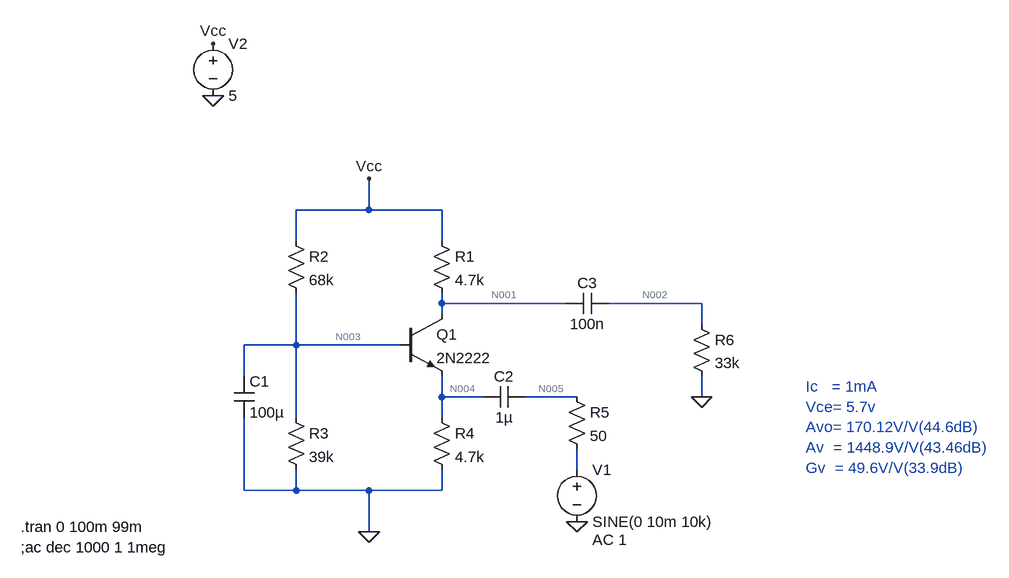
[diagram p0: schematic Example_1.asc]
Example_1.asc, the LTspice schematic file:
Version 4
SHEET 1 1112 680
WIRE 128 -32 128 -80
WIRE 128 -32 16 -32
WIRE 240 -32 128 -32
WIRE 16 16 16 -32
WIRE 240 16 240 -32
WIRE 240 112 240 96
WIRE 432 112 240 112
WIRE 640 112 496 112
WIRE 240 128 240 112
WIRE 640 144 640 112
WIRE 16 176 16 96
WIRE 16 176 -64 176
WIRE 176 176 16 176
WIRE -64 224 -64 176
WIRE 240 256 240 224
WIRE 304 256 240 256
WIRE 448 256 368 256
WIRE 640 256 640 224
WIRE 16 288 16 176
WIRE 240 288 240 256
WIRE 448 368 448 336
WIRE -64 400 -64 288
WIRE 16 400 16 368
WIRE 16 400 -64 400
WIRE 128 400 16 400
WIRE 240 400 240 368
WIRE 240 400 128 400
WIRE 128 464 128 400
FLAG 128 464 0
FLAG 448 448 0
FLAG 640 256 0
FLAG -112 -208 0
FLAG 128 -80 Vcc
FLAG -112 -288 Vcc
SYMBOL npn 176 128 R0
SYMATTR InstName Q1
SYMATTR Value 2N2222
SYMBOL res 224 0 R0
SYMATTR InstName R1
SYMATTR Value 4.7k
SYMBOL res 0 0 R0
SYMATTR InstName R2
SYMATTR Value 68k
SYMBOL res 0 272 R0
SYMATTR InstName R3
SYMATTR Value 39k
SYMBOL res 224 272 R0
SYMATTR InstName R4
SYMATTR Value 4.7k
SYMBOL cap -80 224 R0
SYMATTR InstName C1
SYMATTR Value 100µ
SYMBOL cap 368 240 R90
WINDOW 0 0 32 VBottom 2
WINDOW 3 32 32 VTop 2
SYMATTR InstName C2
SYMATTR Value 1µ
SYMBOL res 432 240 R0
SYMATTR InstName R5
SYMATTR Value 50
SYMBOL voltage 448 352 R0
WINDOW 123 24 124 Left 2
WINDOW 39 0 0 Left 0
SYMATTR Value2 AC 1
SYMATTR InstName V1
SYMATTR Value SINE(0 10m 10k)
SYMBOL cap 496 96 R90
WINDOW 0 0 32 VBottom 2
WINDOW 3 32 32 VTop 2
SYMATTR InstName C3
SYMATTR Value 100n
SYMBOL res 624 128 R0
SYMATTR InstName R6
SYMATTR Value 33k
SYMBOL voltage -112 -304 R0
WINDOW 123 0 0 Left 0
WINDOW 39 0 0 Left 0
SYMATTR InstName V2
SYMATTR Value 5
TEXT -408 456 Left 2 !.tran 0 100m 99m\n;ac dec 1000 1 1meg
TEXT 800 240 Left 2 ;Ic   = 1mA\nVce= 5.7v\nAvo= 170.12V/V(44.6dB)\nAv  = 1448.9V/V(43.46dB)\nGv  = 49.6V/V(33.9dB)

The netlist it stands for:
* Example_1.asc
Q1 N001 N003 N004 0 2N2222
R1 Vcc N001 4.7k
R2 Vcc N003 68k
R3 N003 0 39k
R4 N004 0 4.7k
C1 N003 0 100µ
C2 N005 N004 1µ
R5 N005 N006 50
V1 N006 0 SINE(0 10m 10k) AC 1
C3 N002 N001 100n
R6 N002 0 33k
V2 Vcc 0 5
.model NPN NPN
.model PNP PNP
.lib standard.bjt
.tran 0 100m 99m
;ac dec 1000 1 1meg
* Ic   = 1mA
* Vce= 5.7v
* Avo= 170.12V/V(44.6dB)
* Av  = 1448.9V/V(43.46dB)
* Gv  = 49.6V/V(33.9dB)
.backanno
.end

* Results of the author's LTspice run, read from the files saved beside the schematic
* Operating Point, zero values left out:
*   V(n001) = 3.832 V
*   V(n003) = 1.792 V
*   V(n004) = 1.174 V
*   V(vcc) = 5 V
*   Ic(Q1) = 248.5 µA
*   Ib(Q1) = 1.219 µA
*   Ie(Q1) = -249.7 µA
*   I(R1) = 248.5 µA
*   I(R2) = 47.17 µA
*   I(R3) = 45.95 µA
*   I(R4) = 249.7 µA
*   I(V2) = -295.6 µA
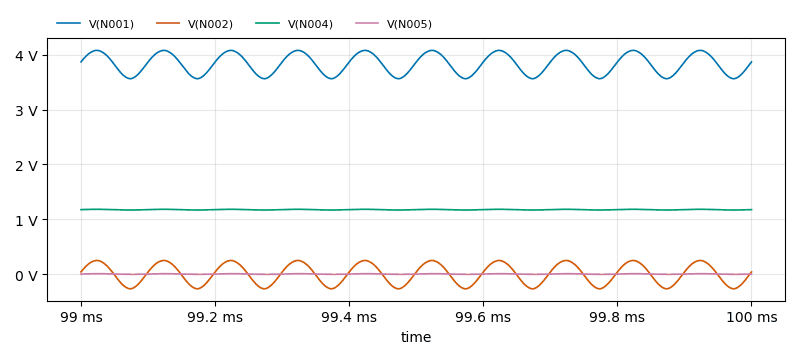
[diagram p1: Transient Analysis of Example_1.asc, plotted from the saved traces]
* Transient Analysis, 1 run:
*   V(N001): min 3.562 V, max 4.079 V, average 3.832 V, rms 3.836 V, last 3.869 V
*   V(N002): min -269.4 mV, max 247.5 mV, average -78.83 µV, rms 181.6 mV, last 38.04 mV
*   V(N004): min 1.167 V, max 1.181 V, average 1.174 V, rms 1.174 V, last 1.175 V
*   V(N005): min -6.639 mV, max 6.889 mV, average 1.042 µV, rms 4.756 mV, last -462.3 µV